# EAGLE schematic shield (EAGLE 9.1.3)
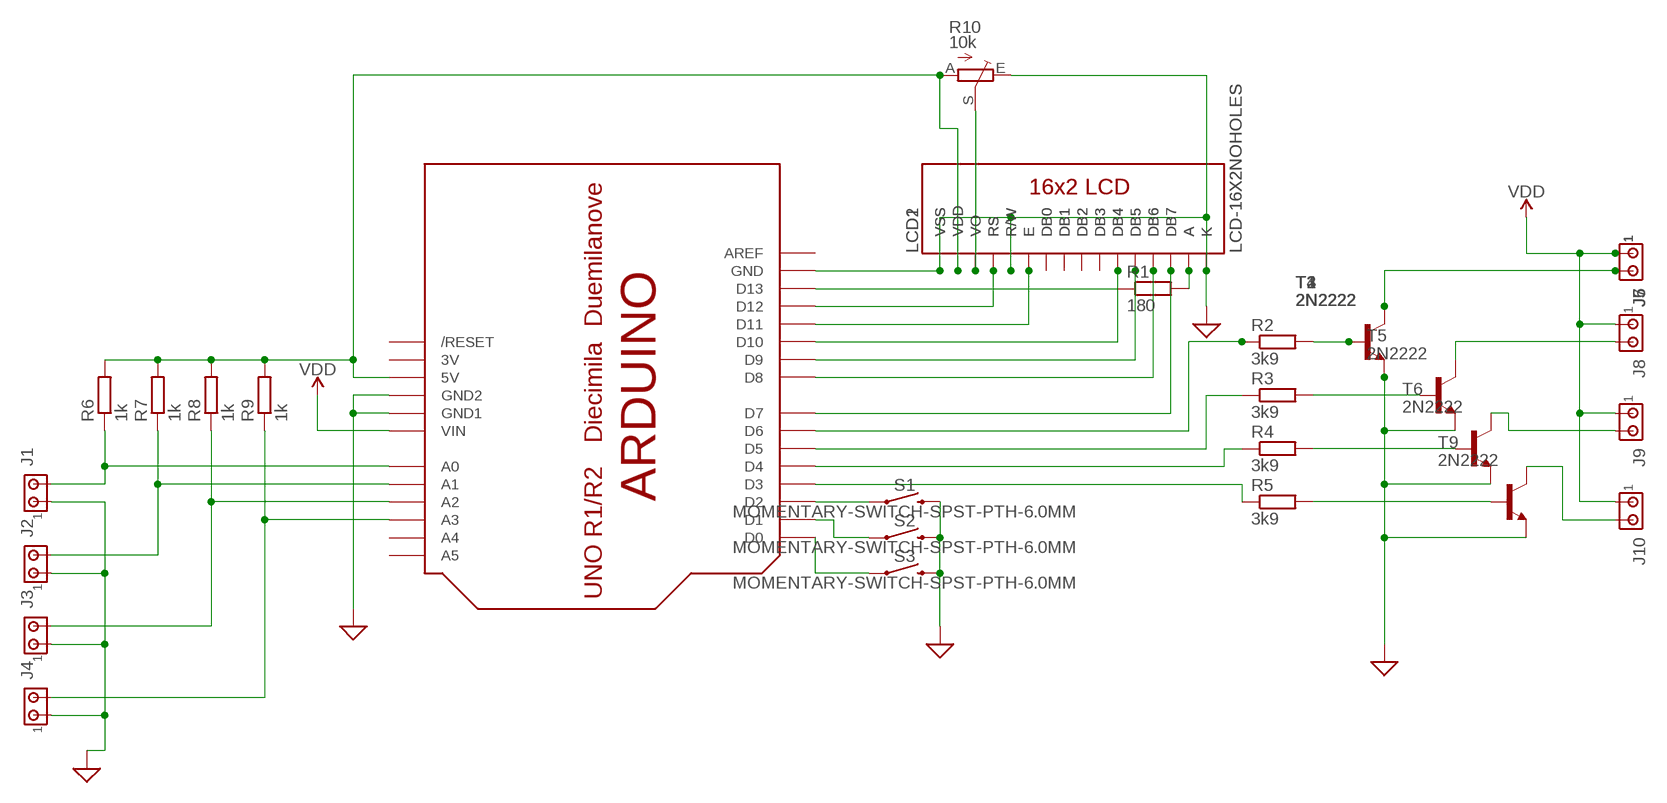
[diagram p0: schematic, sheet 1]

## Parts
J1  MTA02-100  [10X02MTA]
J2  MTA02-100  [10X02MTA]
J3  MTA02-100  [10X02MTA]
J4  MTA02-100  [10X02MTA]
J5  MTA02-100  [10X02MTA]
J6  MTA02-100  [10X02MTA]
J7  MTA02-100  [10X02MTA]
J8  MTA02-100  [10X02MTA]
J9  MTA02-100  [10X02MTA]
J10  MTA02-100  [10X02MTA]
LCD1  LCD-16X2NOHOLES  [LCD-16X2_NOHOLESNOSILK]
LCD2  LCD-16X2NOHOLES  [LCD-16X2_NOHOLESNOSILK]
R1  180  R-EU_0207/10  [0207/10]
R2  3k9  R-EU_0207/10  [0207/10]
R3  3k9  R-EU_0207/10  [0207/10]
R4  3k9  R-EU_0207/10  [0207/10]
R5  3k9  R-EU_0207/10  [0207/10]
R6  1k  R-EU_0207/10  [0207/10]
R7  1k  R-EU_0207/10  [0207/10]
R8  1k  R-EU_0207/10  [0207/10]
R9  1k  R-EU_0207/10  [0207/10]
R10  10k  TRIM_EU-B25P  [B25P]
S1  MOMENTARY-SWITCH-SPST-PTH-6.0MM  [TACTILE_SWITCH_PTH_6.0MM]
S2  MOMENTARY-SWITCH-SPST-PTH-6.0MM  [TACTILE_SWITCH_PTH_6.0MM]
S3  MOMENTARY-SWITCH-SPST-PTH-6.0MM  [TACTILE_SWITCH_PTH_6.0MM]
T1  2N2222  [TO92-EBC-OVAL]
T2  2N2222  [TO92-EBC-OVAL]
T3  2N2222  [TO92-EBC-OVAL]
T4  2N2222  [TO92-EBC-OVAL]
T5  2N2222  [TO92-EBC-OVAL]
T6  2N2222  [TO92-EBC-OVAL]
T9  2N2222  [TO92-EBC-OVAL]
U$1  ARDUINO-NOHOLE  [ARDUINO-NOHOLE]

## Nets
GND: J1.1 J2.1 J3.1 J4.1 LCD1.1(VSS) LCD1.5(R/W) LCD1.16(K) LCD2.1(VSS) LCD2.5(R/W) LCD2.16(K) R10.E S1.3 S2.3 S3.3 T1.E T2.E T3.E T4.E T5.E T6.E T9.E U$1.GND U$1.GND1 U$1.GND2 ; supply symbol labelled SUP
N$1: LCD1.15(A) LCD2.15(A) R1.2
N$2: LCD1.7(DB0) LCD2.7(DB0)
N$3: LCD1.8(DB1) LCD2.8(DB1)
N$4: LCD1.9(DB2) LCD2.9(DB2)
N$5: LCD1.10(DB3) LCD2.10(DB3)
N$6: LCD1.11(DB4) LCD2.11(DB4) U$1.D10
N$7: LCD1.12(DB5) LCD2.12(DB5) U$1.D9
N$8: LCD1.13(DB6) LCD2.13(DB6) U$1.D8
N$9: LCD1.14(DB7) LCD2.14(DB7) U$1.D7
N$10: LCD1.6(E) LCD2.6(E) U$1.D11
N$11: R3.1 U$1.D5
N$12: J1.2 R6.1 U$1.A0
N$13: LCD1.4(RS) LCD2.4(RS) U$1.D12
N$14: LCD1.2(VDD) LCD2.2(VDD) R6.2 R7.2 R8.2 R9.2 R10.A U$1.5V
N$15: LCD1.3(VO) LCD2.3(VO) R10.S
N$16: R4.1 U$1.D4
N$17: R1.1 U$1.D13
N$18: R5.1 U$1.D3
N$19: S3.1 U$1.D0
N$20: R2.1 U$1.D6
N$21: S1.1 U$1.D2
N$22: S2.1 U$1.D1
N$23: J8.2 T5.C
N$24: R3.2 T5.B
N$25: J5.2 J6.2 J7.2 T1.C T2.C T3.C T4.C
N$26: R2.2 T1.B T2.B T3.B T4.B
N$27: J2.2 R7.1 U$1.A1
N$28: R4.2 T6.B
N$29: R5.2 T9.B
N$30: J10.2 T9.C
N$31: J9.2 T6.C
N$32: J3.2 R8.1 U$1.A2
N$33: J4.2 R9.1 U$1.A3
VDD: J5.1 J6.1 J7.1 J8.1 J9.1 J10.1 U$1.VIN
Unconnected: U$1.A4 U$1.A5 U$1.AREF U$1.RESET(/RESET)

## Power pins joined to a net without a drawn wire
3V: U$1.3V

## Library data of the parts
J1-J10 = con-amp:MTA02-100: AMP connector
LCD1 LCD2 = SparkFun-Displays:LCD-16X2: Standard text-only 16x2 parallel input LCD Basic 16 character by 2 line display. Typically utilizes the extremely common HD44780 parallel interface chipset SparkFun Products: Basic 16x2 Green <https://www.sparkfun.com/products/255> Basic 8x2 Green <https://www.sparkfun.com/products/11122>; SF_ID: LCD-00255
R1-R9 = rcl:R-EU_: RESISTOR, European symbol; SPICEPREFIX: R
R10 = pot:TRIM_EU-: POTENTIOMETER
S1-S3 = SparkFun-Switches:MOMENTARY-SWITCH-SPST: Momentary Switch (Pushbutton) - SPST Normally-open (NO) SPST momentary switches (buttons, pushbuttons). Variants PTH-12MM - 12mm square, through-hole Momentary Pushbutton Switch - 12mm Square <https://www.sparkfun.com/products/9190> (COM-09190) PTH-6.0MM, PTH-6.0MM-KIT - 6.0mm square, through-hole Mini Pushbutton Switch <https://www.sparkfun.com/products/97> (COM-00097) KIT package intended for soldering kit's - only one side of pads' copper is exposed. PTH-RIGHT-ANGLE-KIT - Right-angle, through-hole Right Angle Tactile Button <https://www.sparkfun.com/products/10791> - Used on SparkFun BigTime Watch Kit <https://www.sparkfun.com/products/11734> SMD-12MM - 12mm square, surface-mount Tactile Button - SMD (12mm) <https://www.sparkfun.com/products/12993> (COM-12993) Used on SparkFun PicoBoard <https://www.sparkfun.com/products/11888> SMD-4.5MM - 4.5mm Square Trackball Switch Used on SparkFun Blackberry Trackballer Breakout <https://www.sparkfun.com/products/13169> SMD-4.6MMX2.8MM - 4.60mm x 2.80mm, surface mount Used on SparkFun SAMD21 Mini Breakout <https://www.sparkfun.com/products/13664> SMD-5.2MM, SMD-5.2-REDUNDANT - 5.2mm square, surface-mount Mini Pushbutton Switch - SMD <https://www.sparkfun.com/products/8720> (COM-08720) Used on Arduino Pro Mini <https://www.sparkfun.com/products/11114> REDUNDANT package connects both switch circuits together SMD-6.0X3.5MM - 6.0 x 3.5mm, surface mount Momentary Reset Switch SMD <https://www.sparkfun.com/products/8229> (COM-08229) SMD-6.2MM-TALL - 6.2mm square, surface mount Tactile Button - SMD (6mm) <https://www.sparkfun.com/products/12992> Used on SparkFun Digital Sandbox <https://www.sparkfun.com/products/12651> SMD-RIGHT-ANGLE - Right-angle, surface mount Used on SparkFun Block for Intel® Edison - Arduino <https://www.sparkfun.com/products/13036>; PROD_ID: SWCH-08441; SF_SKU: COM-00097
T1-T6 T9 = adafruit:2N2222: NPN TRANSISTOR Big oval pads
U$1 = adafruit:ARDUINO: Arduino Diecimila/Duemilanove Make a shield with ease, this package has all the named pins as well as the two mounting drill holes and an outline of the USB and DC power connector. The outline is on the DIMENSION layer, so if your board house uses it they will cut the outline to match. http://www.ladyada.net/library/pcb/eaglelibrary.html